# EAGLE design shift_register_MOSFET_1 (EAGLE 9.3.0)
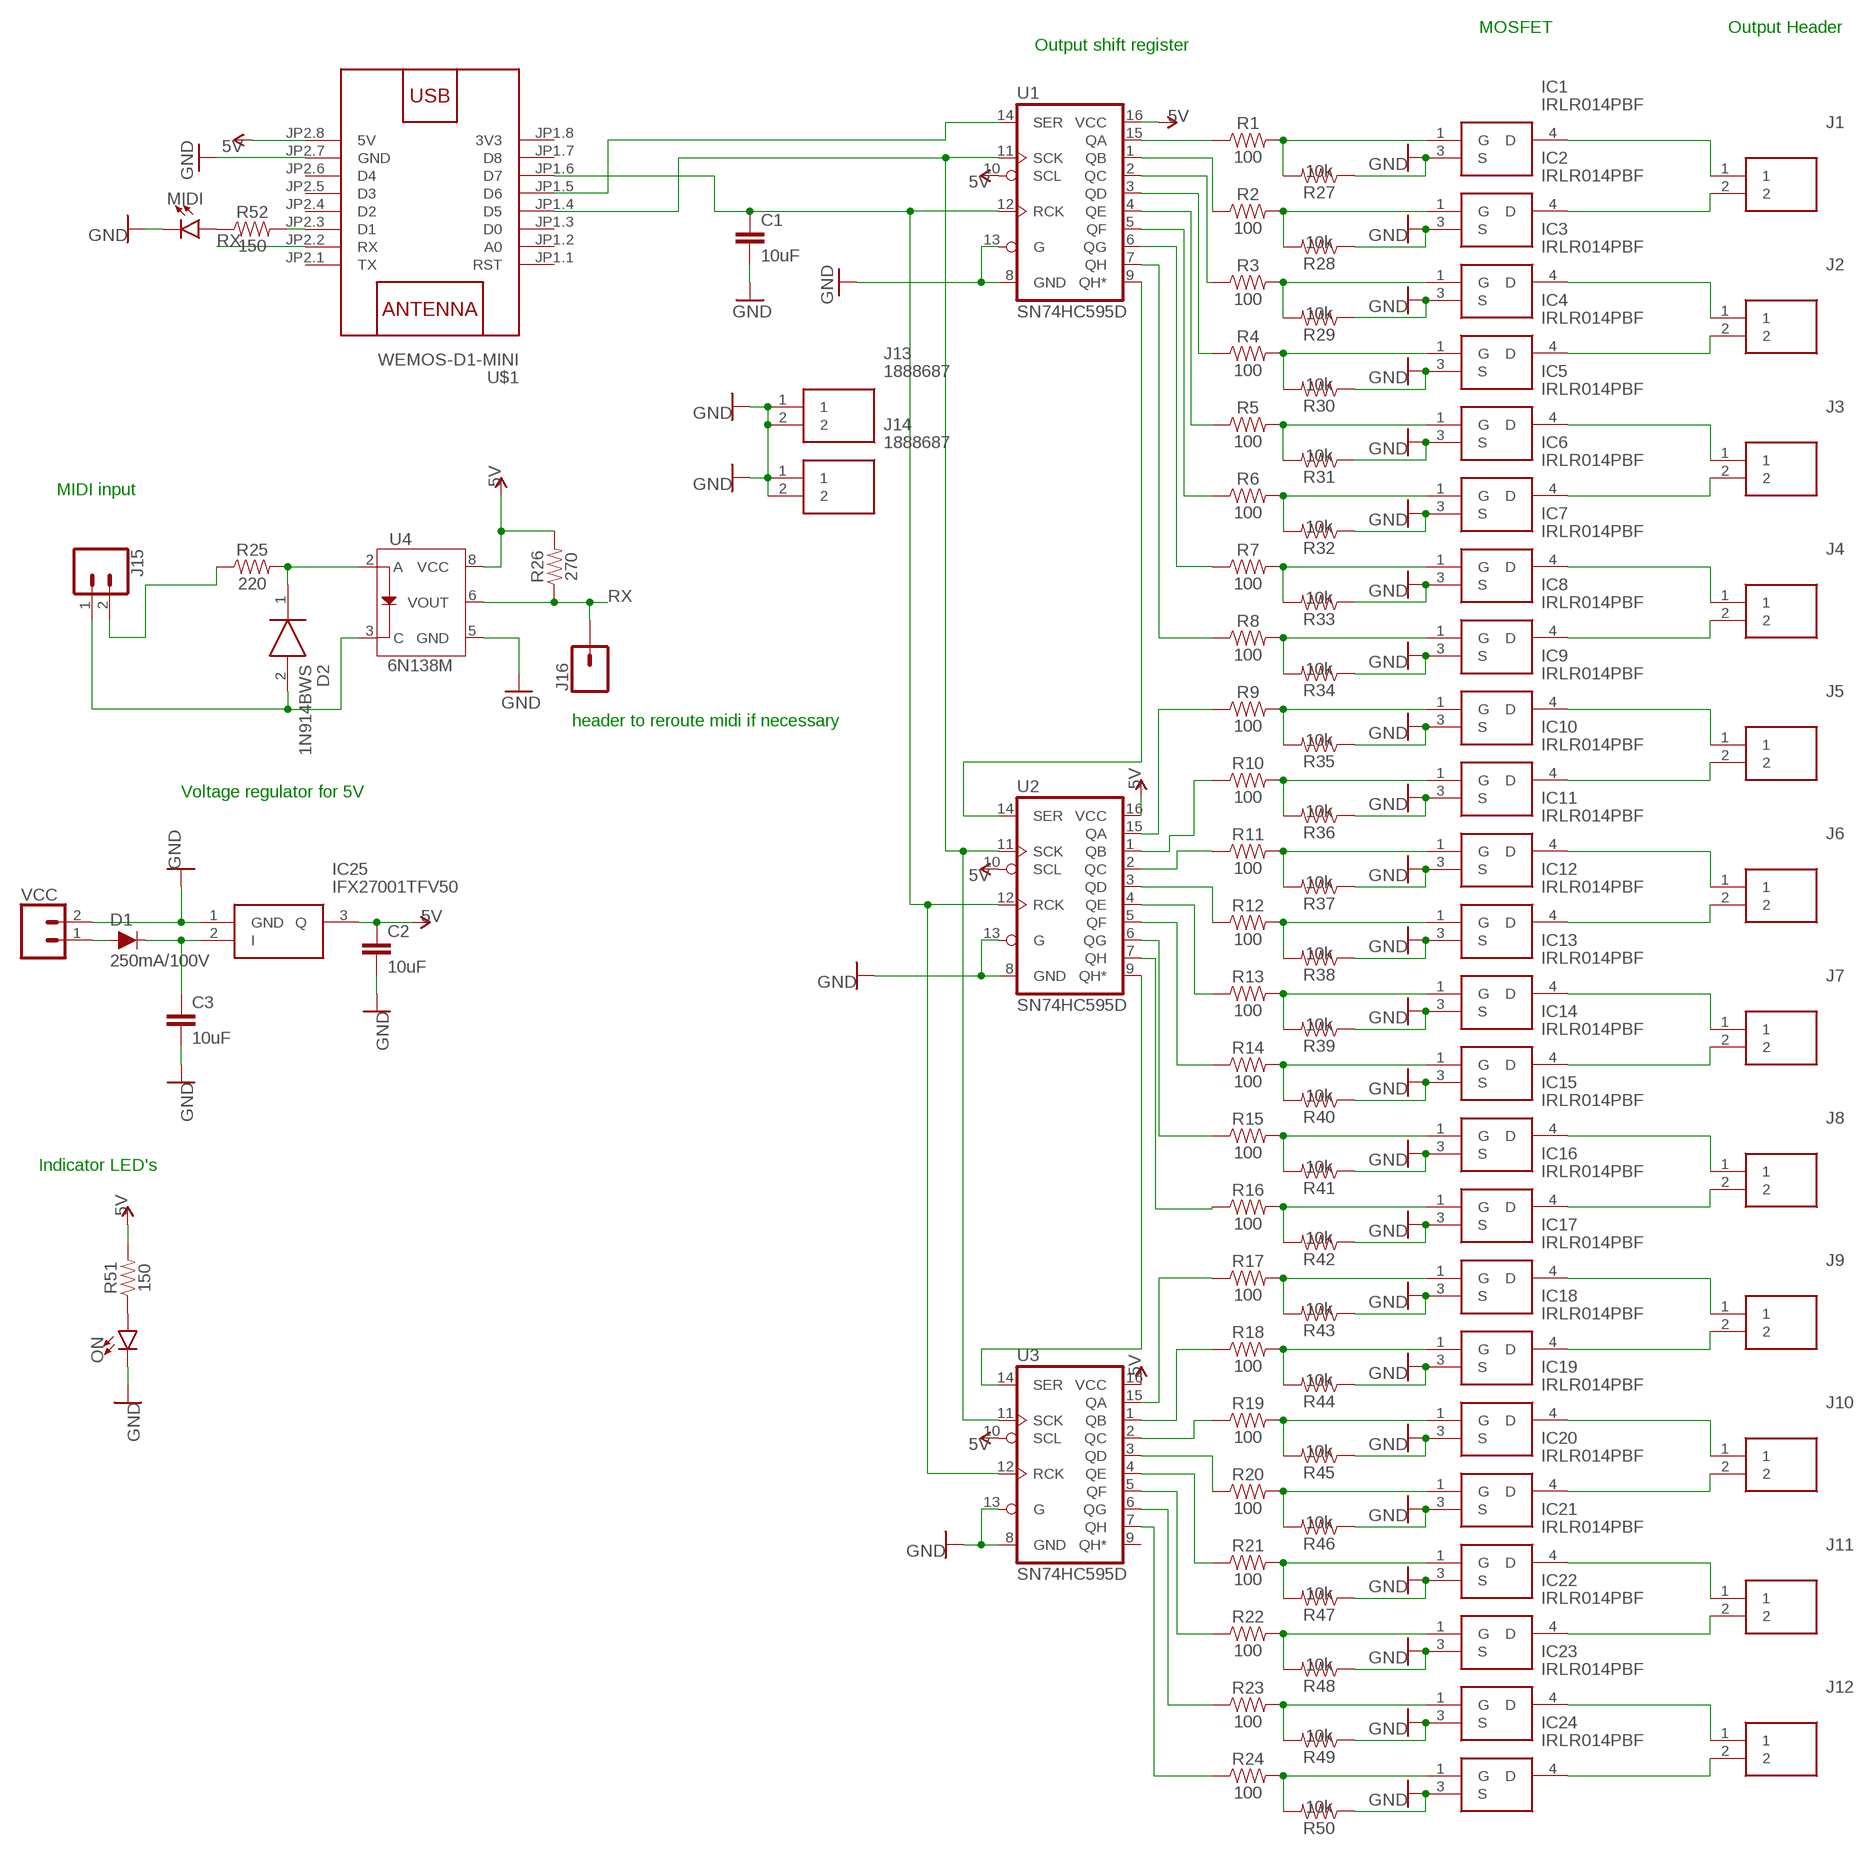
[diagram p0: schematic, sheet 1]

## Parts
C1  10uF  C-EUC0805  [C0805]
C2  10uF  C-EUC0805  [C0805]
C3  10uF  C-EUC0805  [C0805]
D1  250mA/100V  DIODE-BAS16J  [SOD-323]
D2  1N914BWS  [SODFL2513X90N]
IC1  IRLR014PBF  [TO228P990X238-3N]
IC2  IRLR014PBF  [TO228P990X238-3N]
IC3  IRLR014PBF  [TO228P990X238-3N]
IC4  IRLR014PBF  [TO228P990X238-3N]
IC5  IRLR014PBF  [TO228P990X238-3N]
IC6  IRLR014PBF  [TO228P990X238-3N]
IC7  IRLR014PBF  [TO228P990X238-3N]
IC8  IRLR014PBF  [TO228P990X238-3N]
IC9  IRLR014PBF  [TO228P990X238-3N]
IC10  IRLR014PBF  [TO228P990X238-3N]
IC11  IRLR014PBF  [TO228P990X238-3N]
IC12  IRLR014PBF  [TO228P990X238-3N]
IC13  IRLR014PBF  [TO228P990X238-3N]
IC14  IRLR014PBF  [TO228P990X238-3N]
IC15  IRLR014PBF  [TO228P990X238-3N]
IC16  IRLR014PBF  [TO228P990X238-3N]
IC17  IRLR014PBF  [TO228P990X238-3N]
IC18  IRLR014PBF  [TO228P990X238-3N]
IC19  IRLR014PBF  [TO228P990X238-3N]
IC20  IRLR014PBF  [TO228P990X238-3N]
IC21  IRLR014PBF  [TO228P990X238-3N]
IC22  IRLR014PBF  [TO228P990X238-3N]
IC23  IRLR014PBF  [TO228P990X238-3N]
IC24  IRLR014PBF  [TO228P990X238-3N]
IC25  IFX27001TFV50  [PG-TO252-3-11]
J1  1888687  [SHDR2W90P0X508_1X2_1016X950X15]
J2  1888687  [SHDR2W90P0X508_1X2_1016X950X15]
J3  1888687  [SHDR2W90P0X508_1X2_1016X950X15]
J4  1888687  [SHDR2W90P0X508_1X2_1016X950X15]
J5  1888687  [SHDR2W90P0X508_1X2_1016X950X15]
J6  1888687  [SHDR2W90P0X508_1X2_1016X950X15]
J7  1888687  [SHDR2W90P0X508_1X2_1016X950X15]
J8  1888687  [SHDR2W90P0X508_1X2_1016X950X15]
J9  1888687  [SHDR2W90P0X508_1X2_1016X950X15]
J10  1888687  [SHDR2W90P0X508_1X2_1016X950X15]
J11  1888687  [SHDR2W90P0X508_1X2_1016X950X15]
J12  1888687  [SHDR2W90P0X508_1X2_1016X950X15]
J13  1888687  [SHDR2W90P0X508_1X2_1016X950X15]
J14  1888687  [SHDR2W90P0X508_1X2_1016X950X15]
J15  CONN_02  [1X02]
J16  CONN_01  [1X01]
MIDI  LED3MM  [LED_3MM]
ON  LED3MM  [LED_3MM]
R1  100  RESISTOR0805  [0805]
R2  100  RESISTOR0805  [0805]
R3  100  RESISTOR0805  [0805]
R4  100  RESISTOR0805  [0805]
R5  100  RESISTOR0805  [0805]
R6  100  RESISTOR0805  [0805]
R7  100  RESISTOR0805  [0805]
R8  100  RESISTOR0805  [0805]
R9  100  RESISTOR0805  [0805]
R10  100  RESISTOR0805  [0805]
R11  100  RESISTOR0805  [0805]
R12  100  RESISTOR0805  [0805]
R13  100  RESISTOR0805  [0805]
R14  100  RESISTOR0805  [0805]
R15  100  RESISTOR0805  [0805]
R16  100  RESISTOR0805  [0805]
R17  100  RESISTOR0805  [0805]
R18  100  RESISTOR0805  [0805]
R19  100  RESISTOR0805  [0805]
R20  100  RESISTOR0805  [0805]
R21  100  RESISTOR0805  [0805]
R22  100  RESISTOR0805  [0805]
R23  100  RESISTOR0805  [0805]
R24  100  RESISTOR0805  [0805]
R25  220  RESISTOR0805  [0805]
R26  270  RESISTOR0805  [0805]
R27  10k  RESISTOR0805  [0805]
R28  10k  RESISTOR0805  [0805]
R29  10k  RESISTOR0805  [0805]
R30  10k  RESISTOR0805  [0805]
R31  10k  RESISTOR0805  [0805]
R32  10k  RESISTOR0805  [0805]
R33  10k  RESISTOR0805  [0805]
R34  10k  RESISTOR0805  [0805]
R35  10k  RESISTOR0805  [0805]
R36  10k  RESISTOR0805  [0805]
R37  10k  RESISTOR0805  [0805]
R38  10k  RESISTOR0805  [0805]
R39  10k  RESISTOR0805  [0805]
R40  10k  RESISTOR0805  [0805]
R41  10k  RESISTOR0805  [0805]
R42  10k  RESISTOR0805  [0805]
R43  10k  RESISTOR0805  [0805]
R44  10k  RESISTOR0805  [0805]
R45  10k  RESISTOR0805  [0805]
R46  10k  RESISTOR0805  [0805]
R47  10k  RESISTOR0805  [0805]
R48  10k  RESISTOR0805  [0805]
R49  10k  RESISTOR0805  [0805]
R50  10k  RESISTOR0805  [0805]
R51  150  RESISTOR0805  [0805]
R52  150  RESISTOR0805  [0805]
U1  SN74HC595D  74HC595D  [SO16]
U2  SN74HC595D  74HC595D  [SO16]
U3  SN74HC595D  74HC595D  [SO16]
U4  6N138M  OPTO_DARL_6N138S  [8-SMD]
U$1  WEMOS-D1-MINI  [WEMOS-D1-MINI]
VCC  CONN_02  [1X02]

## Nets
5V: C2.1 IC25.3(Q) R26.2 R51.2 U1.10(SCL) U1.16(VCC) U2.10(SCL) U2.16(VCC) U3.10(SCL) U3.16(VCC) U4.8(VCC) U$1.JP2.8(5V)
GND: C1.2 C2.2 C3.2 IC1.3(S) IC2.3(S) IC3.3(S) IC4.3(S) IC5.3(S) IC6.3(S) IC7.3(S) IC8.3(S) IC9.3(S) IC10.3(S) IC11.3(S) IC12.3(S) IC13.3(S) IC14.3(S) IC15.3(S) IC16.3(S) IC17.3(S) IC18.3(S) IC19.3(S) IC20.3(S) IC21.3(S) IC22.3(S) IC23.3(S) IC24.3(S) IC25.1(GND) J13.1 J13.2 J14.1 J14.2 MIDI.K(C) ON.K(C) R27.1 R28.1 R29.1 R30.1 R31.1 R32.1 R33.1 R34.1 R35.1 R36.1 R37.1 R38.1 R39.1 R40.1 R41.1 R42.1 R43.1 R44.1 R45.1 R46.1 R47.1 R48.1 R49.1 R50.1 U1.8(GND) U1.13(G) U2.8(GND) U2.13(G) U3.8(GND) U3.13(G) U4.5(GND) U$1.JP2.7(GND) VCC.2
N$1: IC2.1(G) R2.2 R28.2
N$2: IC1.4(D) J1.1
N$3: R1.1 U1.15(QA)
N$4: D1.A VCC.1
N$5: R8.1 U1.7(QH)
N$6: R7.1 U1.6(QG)
N$7: R2.1 U1.1(QB)
N$8: R5.1 U1.4(QE)
N$9: R6.1 U1.5(QF)
N$10: R4.1 U1.3(QD)
N$11: R3.1 U1.2(QC)
N$12: IC3.1(G) R3.2 R29.2
N$13: IC4.1(G) R4.2 R30.2
N$14: IC5.1(G) R5.2 R31.2
N$15: IC6.1(G) R6.2 R32.2
N$16: IC2.4(D) J1.2
N$17: IC7.1(G) R7.2 R33.2
N$18: IC8.1(G) R8.2 R34.2
N$19: IC1.1(G) R1.2 R27.2
N$20: C3.1 D1.C IC25.2(I)
N$21: U1.9(QH*) U2.14(SER)
N$22: U1.11(SCK) U2.11(SCK) U3.11(SCK) U$1.JP1.4(D5)
N$23: C1.1 U1.12(RCK) U2.12(RCK) U3.12(RCK) U$1.JP1.6(D7)
N$24: U1.14(SER) U$1.JP1.5(D6)
N$25: IC3.4(D) J2.1
N$26: R12.1 U2.3(QD)
N$27: R11.1 U2.2(QC)
N$28: ON.A R51.1
N$29: R9.1 U2.15(QA)
N$30: IC9.1(G) R9.2 R35.2
N$31: IC10.1(G) R10.2 R36.2
N$32: IC11.1(G) R11.2 R37.2
N$33: IC12.1(G) R12.2 R38.2
N$34: IC13.1(G) R13.2 R39.2
N$35: R13.1 U2.4(QE)
N$36: R14.1 U2.5(QF)
N$37: IC4.4(D) J2.2
N$38: R15.1 U2.6(QG)
N$39: R16.1 U2.7(QH)
N$40: U2.9(QH*) U3.14(SER)
N$41: J15.2 R25.1
N$42: IC19.1(G) R19.2 R45.2
N$43: IC20.1(G) R20.2 R46.2
N$44: D2.1(K) R25.2 U4.2(A)
N$45: D2.2(A) J15.1 U4.3(C)
N$46: R17.1 U3.15(QA)
N$47: R18.1 U3.1(QB)
N$48: IC21.1(G) R21.2 R47.2
N$49: IC22.1(G) R22.2 R48.2
N$50: IC23.1(G) R23.2 R49.2
N$51: IC24.1(G) R24.2 R50.2
N$52: IC14.1(G) R14.2 R40.2
N$53: IC15.1(G) R15.2 R41.2
N$54: IC16.1(G) R16.2 R42.2
N$55: IC17.1(G) R17.2 R43.2
N$56: IC18.1(G) R18.2 R44.2
N$57: IC5.4(D) J3.1
N$58: IC6.4(D) J3.2
N$59: IC7.4(D) J4.1
N$60: IC8.4(D) J4.2
N$61: IC9.4(D) J5.1
N$62: IC10.4(D) J5.2
N$63: IC11.4(D) J6.1
N$64: IC12.4(D) J6.2
N$65: IC13.4(D) J7.1
N$66: IC14.4(D) J7.2
N$67: IC15.4(D) J8.1
N$68: IC16.4(D) J8.2
N$69: IC17.4(D) J9.1
N$70: IC18.4(D) J9.2
N$71: IC19.4(D) J10.1
N$72: IC20.4(D) J10.2
N$73: IC21.4(D) J11.1
N$74: IC22.4(D) J11.2
N$75: IC23.4(D) J12.1
N$76: IC24.4(D) J12.2
N$77: R19.1 U3.2(QC)
N$78: R20.1 U3.3(QD)
N$79: R21.1 U3.4(QE)
N$80: R22.1 U3.5(QF)
N$81: R23.1 U3.6(QG)
N$82: R24.1 U3.7(QH)
N$84: R10.1 U2.1(QB)
N$85: MIDI.A R52.1
N$86: R52.2 U$1.JP2.3(D1)
RX: J16.1 R26.1 U4.6(VOUT) U$1.JP2.2(RX)
Unconnected: U3.9(QH*) U$1.JP1.1(RST) U$1.JP1.2(A0) U$1.JP1.3(D0) U$1.JP1.7(D8) U$1.JP2.1(TX) U$1.JP2.4(D2) U$1.JP2.5(D3) U$1.JP2.6(D4)

## Notes on the sheet
- MOSFET | Output Header
- Output shift register
- MIDI input
- header to reroute midi if necessary
- Voltage regulator for 5V
- Indicator LED's

## Power pins joined to a net without a drawn wire
3V3: U$1.JP1.8(3V3)

## Library data of the parts
C1-C3 = Clean-Kong:C-EU: CAPACITOR, European symbol
D1 = SparkFun-DiscreteSemi:DIODE: Diode These are standard reverse protection diodes and small signal diodes. SparkFun Products: SparkFun SparkPunk Sound Kit <https://www.sparkfun.com/products/11177> SparkFun ESP8266 Thing <https://www.sparkfun.com/products/13231>; PROD_ID: DIO-09646
D2 = samacsys:1N914BWS: Diode, Fairchild, 1N914BWS Fairchild 1N914BWS, SMT Diode, 75V 300mA, 4ns, 2-Pin SOD-323F Source: Datasheet <https://www.fairchildsemi.com/datasheets/1N/1N4148WS.pdf>; DESCRIPTION: Diode, Fairchild, 1N914BWS Fairchild 1N914BWS, SMT Diode, 75V 300mA, 4ns, 2-Pin SOD-323F; HEIGHT: 0.9mm; MANUFACTURER_NAME: Fairchild Semiconductor; MANUFACTURER_PART_NUMBER: 1N914BWS; MOUSER_PART_NUMBER: 512-1N914BWS; MOUSER_PRICE-STOCK: https://www.mouser.com/Search/Refine.aspx?Keyword=512-1N914BWS; RS_PART_NUMBER: 8051021P; RS_PRICE-STOCK: http://uk.rs-online.com/web/p/products/8051021P
IC1-IC24 = samacsys:IRLR014PBF: IRLR014PBF, N-channel MOSFET Transistor, 7.7 A 60 V, 3-Pin D-PAK Source: Datasheet <http://www.vishay.com/docs/91321/sihlr014.pdf>; ALLIED_NUMBER: R1081867; ALLIED_PRICE-STOCK: http://www.alliedelec.com/vishay-dale-irlr014pbf/R1081867/; DESCRIPTION: IRLR014PBF, N-channel MOSFET Transistor, 7.7 A 60 V, 3-Pin D-PAK; HEIGHT: mm; MANUFACTURER_NAME: Vishay; MANUFACTURER_PART_NUMBER: IRLR014PBF; MOUSER_PART_NUMBER: 844-IRLR014PBF; MOUSER_PRICE-STOCK: https://www.mouser.com/Search/Refine.aspx?Keyword=844-IRLR014PBF; RS_PART_NUMBER: 1780908; RS_PRICE-STOCK: http://uk.rs-online.com/web/p/products/1780908
IC25 = samacsys:IFX27001TFV50: Infineon IFX27001TFV50 Linear Voltage Regulator, 1A, 5 V, +/-3% 3-Pin DPAK Source: Datasheet <https://www.infineon.com/dgdl/Infineon-IFX27001-DS-v01_01-EN.pdf?fileId=5546d4626176435901619e0eecba517a>; DESCRIPTION: Infineon IFX27001TFV50 Linear Voltage Regulator, 1A, 5 V, +/-3% 3-Pin DPAK; HEIGHT: mm; MANUFACTURER_NAME: Infineon; MANUFACTURER_PART_NUMBER: IFX27001TFV50; RS_PART_NUMBER: 1459664; RS_PRICE-STOCK: http://uk.rs-online.com/web/p/products/1459664
J1-J14 = samacsys:1888687: Phoenix Contact COMBICON MKDSN Series 5.08mm Pitch Straight PCB Terminal Block with Screw Termination, Through Hole Source: Datasheet <https://componentsearchengine.com/Datasheets/1/1888687.pdf>; ALLIED_NUMBER: 70054422; ALLIED_PRICE-STOCK: https://www.alliedelec.com/phoenixcontact-1888687/70054422/; DESCRIPTION: Phoenix Contact COMBICON MKDSN Series 5.08mm Pitch Straight PCB Terminal Block with Screw Termination, Through Hole; HEIGHT: 15mm; MANUFACTURER_NAME: Phoenix Contact; MANUFACTURER_PART_NUMBER: 1888687; MOUSER_PART_NUMBER: 651-1888687; MOUSER_PRICE-STOCK: https://www.mouser.com/Search/Refine.aspx?Keyword=651-1888687; RS_PART_NUMBER: 2509972333; RS_PRICE-STOCK: http://uk.rs-online.com/web/p/products/2509972333
J15 VCC = SparkFun-Connectors:CONN_02: Multi connection point. Often used as Generic Header-pin footprint for 0.1 inch spaced/style header connections On any of the 0.1 inch spaced packages, you can populate with these: Break Away Headers - Straight <https://www.sparkfun.com/products/116> (PRT-00116) Break Away Male Headers - Right Angle <https://www.sparkfun.com/products/553> (PRT-00553) Female Headers <https://www.sparkfun.com/products/115> (PRT-00115) Break Away Headers - Machine Pin <https://www.sparkfun.com/products/117> (PRT-00117) Break Away Female Headers - Swiss Machine Pin <https://www.sparkfun.com/products/743> (PRT-00743) For SCREWTERMINALS and SPRING TERMINALS visit here: Screw Terimnals on SparkFun.com <https://www.sparkfun.com/search/results?term=Screw+Terminals> (5mm/3.5mm/2.54mm spacing) This device is also useful as a general connection point to wire up your design to another part of your project. Our various solder wires solder well into these plated through hole pads. Hook-Up Wire - Assortment (Stranded, 22 AWG) <https://www.sparkfun.com/products/11375> (PRT-11375) Hook-Up Wire - Assortment (Solid Core, 22 AWG) <https://www.sparkfun.com/products/11367> (PRT-11367) View the entire wire category on our website here <https://www.sparkfun.com/categories/141> Special notes: Molex polarized connector foot print use with: PRT-08233 with associated crimp pins and housings. 2.54_SCREWTERM for use with PRT-10571. 3.5mm Screw Terminal footprints for PRT-08084 5mm Screw Terminal footprints for use with PRT-08432
J16 = SparkFun-Connectors:CONN_01: Single connection point. Often used as Generic Header-pin footprint for 0.1 inch spaced/style header connections On any of the 0.1 inch spaced packages, you can populate with these: Break Away Headers - Straight <https://www.sparkfun.com/products/116> (PRT-00116) Break Away Male Headers - Right Angle <https://www.sparkfun.com/products/553> (PRT-00553) Female Headers <https://www.sparkfun.com/products/115> (PRT-00115) Break Away Headers - Machine Pin <https://www.sparkfun.com/products/117> (PRT-00117) Break Away Female Headers - Swiss Machine Pin <https://www.sparkfun.com/products/743> (PRT-00743) This device is also useful as a general connection point to wire up your design to another part of your project. Our various solder wires solder well into these plated through hole pads. Hook-Up Wire - Assortment (Stranded, 22 AWG) <https://www.sparkfun.com/products/11375> (PRT-11375) Hook-Up Wire - Assortment (Solid Core, 22 AWG) <https://www.sparkfun.com/products/11367> (PRT-11367) View the entire wire category on our website here <https://www.sparkfun.com/categories/141> Special notes: SMTSO-256-ET is a "flush mount" nut for a 4-40 screw. We mostly use this on specialty testbeds; it is a nice way to connect hardware to your PCB at an adjustable hieght. Also note, the SNAP packages are for using a snappable style connector. We sell a baggie of snaps and they are also used on two LilyPad designs: Snap Assortment - 30 pack (male and female) <https://www.sparkfun.com/products/11347> (DEV-11347) LilyPad Arduino SimpleSnap <https://www.sparkfun.com/products/10941> (DEV-10941) LilyPad SimpleSnap Protoboard <https://www.sparkfun.com/products/10940> (DEV-10940)
MIDI ON = SparkFun-LED:LED: LED (Generic) Standard schematic elements and footprints for 5mm, 3mm, 1206, and 0603 sized LEDs. Generic LEDs with no color specified.; PROD_ID: DIO-08794
R1-R52 = SparkFun-Resistors:RESISTOR: Generic Resistor Package
U1-U3 = SparkFun-IC-Logic:74*595: 8-Bit Shift Register (Serial to Parallel) Datasheet <http://cdn.sparkfun.com/datasheets/BreakoutBoards/MM74HC595.pdf> SparkFun Products SparkFun Shift Register Breakout - 74HC595 <https://www.sparkfun.com/products/10680> (BOB-10680); PROD_ID: IC-07875
U4 = SparkFun-DiscreteSemi:OPTO_DARL_6N138S: Optoisolator, darlington pair output Optocoupler consisting of an AlGaAs LED optically coupled to a high gain split darlington photodetector. SparkFun Products: SparkFun MIDI Shield <https://www.sparkfun.com/products/12898>; PROD_ID: IC-09482
U$1 = diy-modules:WEMOS-D1-MINI: WEMOS D1 mini: Mini Wi-Fi Board based on ESP-8266 device More details can be found here: https://www.wemos.cc/product/d1-mini.html Click here to find device on ebay.com <http://www.ebay.com/sch/wemos+d1+mini+nodemcu>

## Board
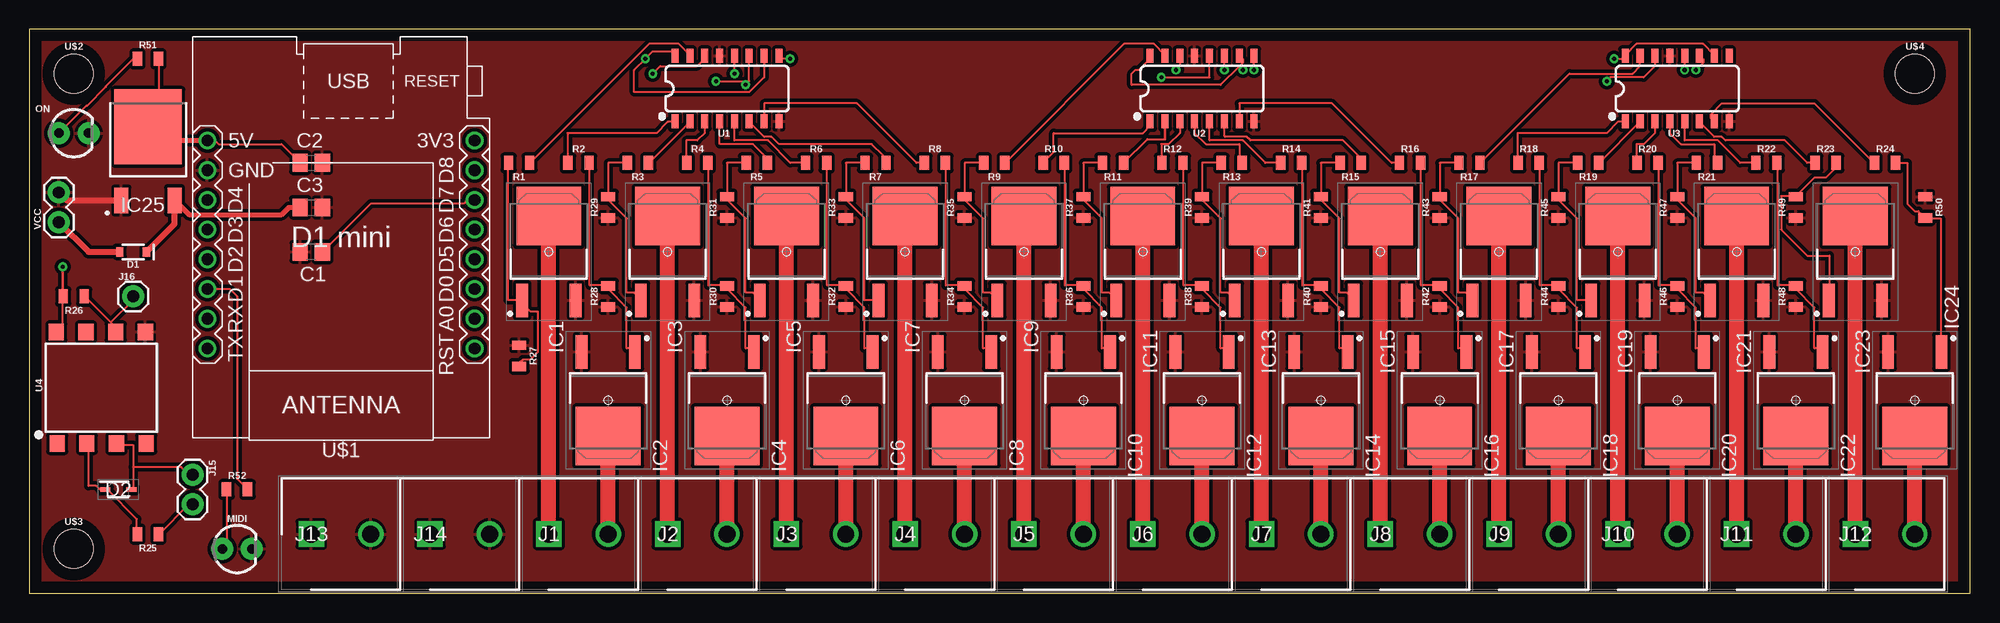
[diagram p1: board, top side]
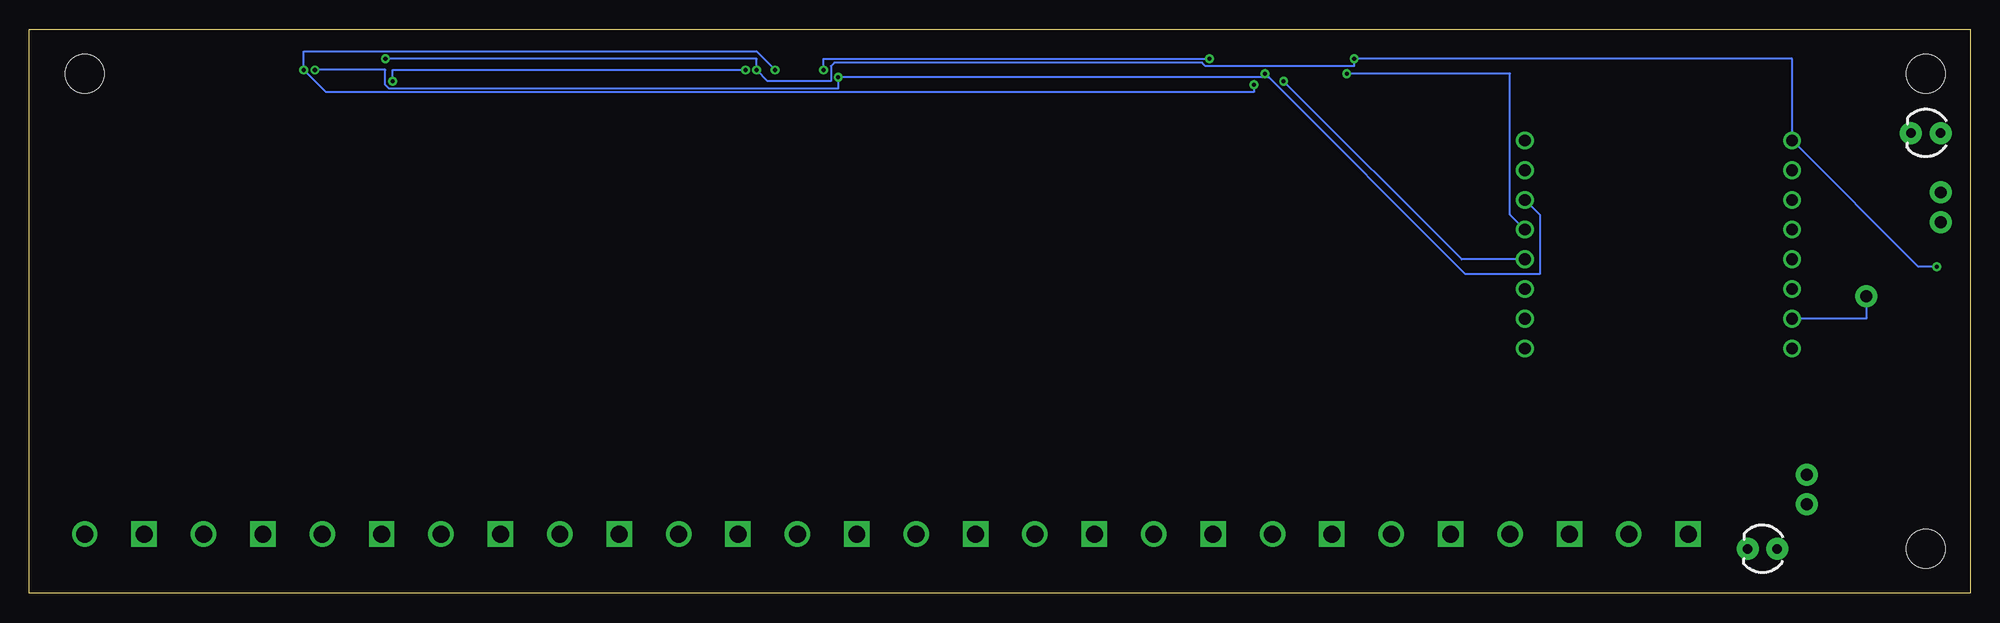
[diagram p2: board, bottom side, seen from below]

Size 166.04 x 48.25 mm. Coordinates in mm from the lower left corner, seen from the top.
Outline: 0,0 166.04,0 166.04,48.25 0,48.25 0,0
Copper layers (1*16): Top 0.035mm / dielectric 1.5mm / Bottom 0.035mm
Design rules "default": minimum track width 6mil, minimum drill 0.35mm, track to track 6mil, track to pad 6mil, pad to pad 6mil, via to via 6mil, smd to smd 6mil, copper to edge 40mil, drill to drill 6mil, minimum pad ring 10mil, minimum via ring 8mil, stop-mask expansion 4mil, vias tented up to drill 0mil, thermal gap 10mil

### Footprints (pad centres in the part's own frame; a part is rotated, then mirrored left to right if it is on the bottom)
C0805 = smd 1.3 x 1.5: 1 -0.95,0; 2 0.95,0
SOD-323 = smd 0.63 x 0.83: A 1.15,0; C -1.15,0
SODFL2513X90N = smd 0.87 x 0.42: 1 -1.125,0; 2 1.125,0
TO228P990X238-3N = smd 2.85 x 1: 1 -4.15,2.28; 3 -4.15,-2.28 | smd 5 x 5.55: 4 3.05,0
PG-TO252-3-11 = smd 1.2 x 2.2: 1 -2.28,-8.3; 2 2.28,-8.3 | smd 5.8 x 6.4: 3 0,-2
SHDR2W90P0X508_1X2_1016X950X15 = drill 1.45 pad 2.175 square: 1 0,0 | drill 1.45 pad 2.175: 2 5.08,0
1X02 = drill 1.016 pad 1.88: 1 0,0; 2 2.54,0
1X01 = drill 1.016 pad 1.88: 1 0,0
LED_3MM = drill 0.813 pad 1.88: A -1.27,0; K 1.27,0
0805 = smd 0.8 x 1.2: 1 -0.9,0; 2 0.9,0
SO16 = smd 0.6 x 1.2: 1 -4.445,-2.8; 2 -3.175,-2.8; 3 -1.905,-2.8; 4 -0.635,-2.8; 5 0.635,-2.8; 6 1.905,-2.8; 7 3.175,-2.8; 8 4.445,-2.8; 9 4.445,2.8; 10 3.175,2.8; 11 1.905,2.8; 12 0.635,2.8; 13 -0.635,2.8; 14 -1.905,2.8; 15 -3.175,2.8; 16 -4.445,2.8
8-SMD = smd 1.3 x 1.4: 1 -3.96,-4.96; 2 -1.42,-4.96; 3 1.12,-4.96; 4 3.66,-4.96; 5 3.59,4.58; 6 1.05,4.58; 7 -1.49,4.58; 8 -4.03,4.58
WEMOS-D1-MINI = drill 1: JP1.1 -11.43,9.525; JP1.2 -11.43,6.985; JP1.3 -11.43,4.445; JP1.4 -11.43,1.905; JP1.5 -11.43,-0.635; JP1.6 -11.43,-3.175; JP1.7 -11.43,-5.715; JP1.8 -11.43,-8.255; JP2.1 11.43,9.525; JP2.2 11.43,6.985; JP2.3 11.43,4.445; JP2.4 11.43,1.905; JP2.5 11.43,-0.635; JP2.6 11.43,-3.175; JP2.7 11.43,-5.715; JP2.8 11.43,-8.255
STAND-OFF = hole 3.302: 0,0

### Placement (x,y rotation side)
C1  24.13,29.21 180 top
C2  24.13,36.83 0 top
C3  24.13,33.02 0 top
D1  8.89,29.21 180 top
D2  7.62,8.89 0 top
IC1  44.45,29.21 90 top
IC2  49.53,16.51 270 top
IC3  54.61,29.21 90 top
IC4  59.69,16.51 270 top
IC5  64.77,29.21 90 top
IC6  69.85,16.51 270 top
IC7  74.93,29.21 90 top
IC8  80.01,16.51 270 top
IC9  85.09,29.21 90 top
IC10  90.17,16.51 270 top
IC11  95.25,29.21 90 top
IC12  100.33,16.51 270 top
IC13  105.41,29.21 90 top
IC14  110.49,16.51 270 top
IC15  115.57,29.21 90 top
IC16  120.65,16.51 270 top
IC17  125.73,29.21 90 top
IC18  130.81,16.51 270 top
IC19  135.89,29.21 90 top
IC20  140.97,16.51 270 top
IC21  146.05,29.21 90 top
IC22  151.13,16.51 270 top
IC23  156.21,29.21 90 top
IC24  161.29,16.51 270 top
IC25  10.16,41.91 0 top
J1  44.45,5.08 0 top
J2  54.61,5.08 0 top
J3  64.77,5.08 0 top
J4  74.93,5.08 0 top
J5  85.09,5.08 0 top
J6  95.25,5.08 0 top
J7  105.41,5.08 0 top
J8  115.57,5.08 0 top
J9  125.73,5.08 0 top
J10  135.89,5.08 0 top
J11  146.05,5.08 0 top
J12  156.21,5.08 0 top
J13  24.13,5.08 0 top
J14  34.29,5.08 0 top
J15  13.97,10.16 270 top
J16  8.89,25.4 0 top
MIDI  17.78,3.81 0 top
ON  3.81,39.37 0 top
R1  41.91,36.83 180 top
R2  46.99,36.83 0 top
R3  52.07,36.83 180 top
R4  57.15,36.83 0 top
R5  62.23,36.83 180 top
R6  67.31,36.83 0 top
R7  72.39,36.83 180 top
R8  77.47,36.83 0 top
R9  82.55,36.83 180 top
R10  87.63,36.83 0 top
R11  92.71,36.83 180 top
R12  97.79,36.83 0 top
R13  102.87,36.83 180 top
R14  107.95,36.83 0 top
R15  113.03,36.83 180 top
R16  118.11,36.83 0 top
R17  123.19,36.83 180 top
R18  128.27,36.83 0 top
R19  133.35,36.83 180 top
R20  138.43,36.83 0 top
R21  143.51,36.83 180 top
R22  148.59,36.83 0 top
R23  153.67,36.83 0 top
R24  158.75,36.83 0 top
R25  10.16,5.08 180 top
R26  3.81,25.4 180 top
R27  41.91,20.32 270 top
R28  49.53,25.4 90 top
R29  49.53,33.02 90 top
R30  59.69,25.4 90 top
R31  59.69,33.02 90 top
R32  69.85,25.4 90 top
R33  69.85,33.02 90 top
R34  80.01,25.4 90 top
R35  80.01,33.02 90 top
R36  90.17,25.4 90 top
R37  90.17,33.02 90 top
R38  100.33,25.4 90 top
R39  100.33,33.02 90 top
R40  110.49,25.4 90 top
R41  110.49,33.02 90 top
R42  120.65,25.4 90 top
R43  120.65,33.02 90 top
R44  130.81,25.4 90 top
R45  130.81,33.02 90 top
R46  140.97,25.4 90 top
R47  140.97,33.02 90 top
R48  151.13,25.4 90 top
R49  151.13,33.02 90 top
R50  162.18,33.02 270 top
R51  10.16,45.72 0 top
R52  17.78,8.89 0 top
U1  59.69,43.18 0 top
U2  100.33,43.18 0 top
U3  140.97,43.18 0 top
U4  6.35,17.78 0 top
U$1  26.67,30.48 180 top
U$2  [STAND-OFF]  3.81,44.45 0 top
U$3  [STAND-OFF]  3.81,3.81 0 top
U$4  [STAND-OFF]  161.29,44.45 0 top
VCC  2.54,31.75 90 top

### Tracks (layer width: path | path; a pad name or v marks a point on that pad's centre or on a via)
5V  (via drill 0.35)
  Top 0.152: U3.10 144.15,46.04 143.19,46.99 137.48,46.99 136.53,46.04 U3.16 136.53,45.72 v135.57,45.72 | 103.5,45.09 103.82,45.4 103.82,45.72 103.5,45.72 U2.10 | 103.5,45.09 101.92,43.5 94.3,43.5 94.3,44.45 94.61,44.77 94.93,44.77 95.89,45.72 U2.16 | 103.5,45.09 v103.82,44.77 | U1.10 62.87,44.13 61.59,42.86 51.75,42.86 51.75,44.77 v52.7,45.72 53.34,46.35 54.93,46.35 55.24,46.04 U1.16 | R26.2 2.86,25.4 v2.86,27.94 2.86,22.54 2.54,22.54 U4.8 | U$1.JP2.8 15.88,38.73 16.19,38.42 21.59,38.42 C2.1 | R51.2 11.06,40.81 IC25.3
  Top 0.406: IC25.3 11.34,38.73 U$1.JP2.8
  Bottom 0.152: v135.57,45.72 103.82,45.72 v103.82,44.77 102.87,43.81 97.47,43.81 97.47,45.09 97.16,45.4 65.72,45.4 65.41,45.09 52.7,45.09 v52.7,45.72 15.24,45.72 U$1.JP2.8 4.45,27.94 v2.86,27.94
GND
  Top 0.508: VCC.2 3.22,33.61 IC25.1
  pour Top (isolate 0.305): 0,0 0,48.26 165.74,48.26 165.74,0
N$1
  Top 0.152: IC2.1 51.75,20.95 51.12,20.95 51.12,24.45 49.53,26.04 R28.2 49.53,26.35 47.94,26.35 47.94,36.83 R2.2
N$2
  Top 0.152: IC1.4 44.45,31.75
  Top 1.27: J1.1 44.45,31.75
N$3
  Top 0.152: R1.1 42.86,36.83 53.02,46.99 55.56,46.99 56.52,46.04 U1.15
N$4
  Top 0.508: VCC.1 5.08,29.21 D1.A
N$5
  Top 0.152: U1.7 62.87,41.91 70.8,41.91 75.88,36.83 R8.1
N$6
  Top 0.152: U1.6 61.59,40.32 62.87,39.05 63.5,39.05 64.14,38.42 72.07,38.42 73.03,37.47 73.03,36.83 R7.1
N$7
  Top 0.152: R2.1 46.04,36.83 46.04,39.37 53.66,39.37 54.61,40.32 55.24,40.32 U1.1
N$8
  Top 0.152: U1.4 59.05,38.42 61.91,38.42 62.87,37.47 62.87,36.83 R5.1
N$9
  Top 0.152: U1.5 60.33,38.73 63.18,38.73 65.09,36.83 R6.1
N$10
  Top 0.152: U1.3 57.78,39.37 57.15,38.73 56.2,38.73 56.2,36.83 R4.1
N$11
  Top 0.152: R3.1 53.02,36.83 56.52,40.32 U1.2
N$12
  Top 0.152: R3.2 49.53,36.83 R29.2 49.53,33.66 51.12,32.07 51.12,25.72 51.75,25.72 52.39,25.08 IC3.1
N$13
  Top 0.152: IC4.1 61.91,20.95 61.28,20.95 61.28,24.45 59.69,26.04 R30.2 59.69,26.35 58.1,26.35 58.1,36.83 R4.2
N$14
  Top 0.152: R5.2 59.69,36.83 R31.2 59.69,33.66 61.28,32.07 61.28,25.72 61.91,25.72 62.55,25.08 IC5.1
N$15
  Top 0.152: IC6.1 72.07,20.95 71.44,20.95 71.44,24.45 69.85,26.04 R32.2 69.85,26.35 68.26,26.35 68.26,36.83 R6.2
N$16
  Top 1.27: J1.2 IC2.4
N$17
  Top 0.152: R7.2 69.85,36.83 R33.2 69.85,33.66 71.44,32.07 71.44,25.08 72.39,25.08 IC7.1
N$18
  Top 0.152: IC8.1 82.23,20.95 81.6,20.95 81.6,24.45 80.01,26.04 R34.2 80.01,26.35 78.42,26.35 78.42,36.83 R8.2
N$19
  Top 0.152: R27.2 41.91,19.68 42.23,20 42.86,20 43.5,20.64 43.5,24.13 42.86,24.13 42.23,24.77 IC1.1 41.91,25.08 40.96,25.08 40.96,36.83 R1.2
N$20
  Top 0.406: IC25.2 13.66,32.38 21.59,32.38 22.23,33.02 C3.1
  Top 0.508: D1.C 12.44,31.61 IC25.2
N$21  (via drill 0.35)
  Top 0.152: v65.09,45.72 64.14,45.72 U1.9 | v98.11,44.77 98.42,45.09 U2.14
  Bottom 0.152: v65.09,45.72 98.11,45.72 v98.11,44.77
N$22  (via drill 0.35)
  Top 0.152: v102.23,44.77 U2.11 | v142.56,44.77 143.19,45.4 143.19,45.72 142.88,45.72 U3.11 | U1.11 61.59,43.81 61.28,43.81 | v58.74,43.81 61.28,43.81 | 61.28,43.81 v61.28,43.5
  Bottom 0.152: v102.23,44.77 103.82,46.35 142.56,46.35 v142.56,44.77 140.65,42.86 61.28,42.86 v61.28,43.5 | v58.74,43.81 43.5,28.57 U$1.JP1.4
N$23  (via drill 0.35)
  Top 0.152: v60.33,44.45 U1.12 | U2.12 100.97,44.13 v96.84,44.13 | v141.6,44.77 U3.12 | U$1.JP1.6 37.47,33.66 37.15,33.34 29.21,33.34 C1.1
  Bottom 0.152: 60.01,44.13 43.18,27.3 36.83,27.3 36.83,32.38 U$1.JP1.6 | 60.01,44.13 v60.33,44.45 | 60.01,44.13 v96.84,44.13 96.84,43.18 135.25,43.18 135.57,43.5 135.57,44.77 v141.6,44.77
N$24  (via drill 0.35)
  Top 0.152: v53.34,44.45 53.98,45.09 57.15,45.09 57.78,45.72 U1.14
  Bottom 0.152: v53.34,44.45 39.37,44.45 39.37,32.38 U$1.JP1.5
N$25
  Top 1.27: J2.1 IC3.4
N$26
  Top 0.152: U2.3 98.42,39.37 97.47,38.42 96.84,38.42 96.84,36.83 R12.1
N$27
  Top 0.152: R11.1 95.64,38.86 97.16,38.86
  Top 0.2: 97.16,38.86 U2.2
N$28
  Top 0.152: R51.1 8.89,45.72 6.55,43.38 6.55,43.31 4.95,41.71 4.88,41.71 ON.A
N$29
  Top 0.152: R9.1 83.5,36.83 93.66,46.99 96.2,46.99 97.16,46.04 U2.15
N$30
  Top 0.152: R9.2 80.01,36.83 R35.2 80.01,33.66 81.6,32.07 81.6,25.72 82.23,25.72 82.87,25.08 IC9.1
N$31
  Top 0.152: IC10.1 92.39,20.95 91.76,20.95 91.76,24.45 90.17,26.04 R36.2 90.17,26.35 88.58,26.35 88.58,36.83 R10.2
N$32
  Top 0.152: R11.2 90.17,36.83 R37.2 90.17,33.66 91.76,32.07 91.76,25.72 92.39,25.72 93.03,25.08 IC11.1
N$33
  Top 0.152: IC12.1 102.55,20.95 101.92,20.95 101.92,24.45 100.33,26.04 R38.2 100.33,26.35 98.74,26.35 98.74,36.83 R12.2
N$34
  Top 0.152: R13.2 100.33,36.83 R39.2 100.33,33.66 101.92,32.07 101.92,25.72 102.55,25.72 103.19,25.08 IC13.1
N$35
  Top 0.152: U2.4 99.69,39.37 100.65,38.42 103.5,38.42 103.5,36.83 R13.1
N$36
  Top 0.152: U2.5 100.97,38.73 103.82,38.73 105.73,36.83 R14.1
N$37
  Top 1.27: J2.2 IC4.4
N$38
  Top 0.152: R15.1 113.67,36.83 113.67,37.47 112.39,38.73 104.46,38.73 104.14,39.05 102.3,39.05 102.23,39.12 U2.6
N$39
  Top 0.152: U2.7 103.5,41.91 111.44,41.91 116.52,36.83 R16.1
N$40  (via drill 0.35)
  Top 0.152: v104.78,44.77 U2.9 | v134.94,43.81 135.25,44.13 138.11,44.13 139.06,45.09 U3.14
  Bottom 0.152: v104.78,44.77 134.94,44.77 v134.94,43.81
N$41
  Top 0.152: J15.2 13.65,7.62 11.11,5.08 R25.1
N$42
  Top 0.152: R19.2 130.81,36.83 R45.2 130.81,33.66 132.4,32.07 132.4,25.08 133.35,25.08 IC19.1
N$43
  Top 0.152: IC20.1 143.19,20.95 142.56,20.95 142.56,24.45 140.97,26.04 R46.2 140.97,26.35 139.38,26.35 139.38,36.83 R20.2
N$44
  Top 0.152: R25.2 9.21,5.08 9.21,6.35 6.67,8.89 D2.1 6.03,8.89 5.71,9.21 5.08,9.21 5.08,12.7 U4.2
N$45
  Top 0.152: 8.89,10.79 8.89,12.7 7.62,12.7 U4.3 | 8.89,10.79 8.89,8.89 D2.2 | 8.89,10.79 13.02,10.79 13.65,10.16 J15.1
N$46
  Top 0.152: R17.1 124.14,36.83 131.76,44.45 137.16,44.45 137.79,45.09 U3.15
N$47
  Top 0.152: R18.1 127.32,36.83 127.32,39.37 134.94,39.37 135.89,40.32 136.53,40.32 U3.1
N$48
  Top 0.152: R21.2 140.97,36.83 R47.2 140.97,33.66 142.56,32.07 142.56,25.72 143.19,25.72 143.83,25.08 IC21.1
N$49
  Top 0.152: IC22.1 153.35,20.95 152.72,20.95 152.72,24.45 151.13,26.04 R48.2 151.13,26.35 149.54,26.35 149.54,36.51
  Top 0.2: R22.2 149.54,36.78 149.54,36.51
N$50
  Top 0.152: 151.13,33.97 152.72,35.56 153.67,35.56 154.31,36.2 154.31,36.83 R23.2 | 151.13,33.97 149.86,33.97 149.86,31.11 152.08,28.89 153.99,28.89 153.99,25.08 IC23.1 | 151.13,33.97 R49.2
N$51
  Top 0.152: R24.2 160.66,36.83 160.66,33.34 161.29,32.7 161.61,32.7 161.93,32.38 R50.2 162.24,32.07 163.51,32.07 163.51,20.95 IC24.1
N$52
  Top 0.152: IC14.1 112.71,20.95 112.08,20.95 112.08,24.45 110.49,26.04 R40.2 110.49,26.35 108.9,26.35 108.9,36.83 R14.2
N$53
  Top 0.152: R15.2 110.49,36.83 R41.2 110.49,33.66 112.08,32.07 112.08,25.72 112.71,25.72 113.35,25.08 IC15.1
N$54
  Top 0.152: IC16.1 122.87,20.95 122.24,20.95 122.24,24.45 120.65,26.04 R42.2 120.65,26.35 119.06,26.35 119.06,36.83 R16.2
N$55
  Top 0.152: R17.2 120.65,36.83 R43.2 120.65,33.66 122.24,32.07 122.24,25.72 122.87,25.72 123.51,25.08 IC17.1
N$56
  Top 0.152: IC18.1 133.03,20.95 132.4,20.95 132.4,24.45 130.81,26.04 R44.2 130.81,26.35 129.22,26.35 129.22,36.83 R18.2
N$57
  Top 1.27: J3.1 IC5.4
N$58
  Top 1.27: J3.2 IC6.4 | IC6.4 69.85,15.24 71.12,13.97 71.12,12.7 70.61,12.7 IC6.4
N$59
  Top 1.27: J4.1 IC7.4
N$60
  Top 1.27: J4.2 IC8.4
N$61
  Top 1.27: J5.1 IC9.4
N$62
  Top 1.27: J5.2 IC10.4
N$63
  Top 1.27: J6.1 IC11.4
N$64
  Top 1.27: J6.2 IC12.4
N$65
  Top 1.27: J7.1 IC13.4
N$66
  Top 1.27: J7.2 IC14.4
N$67
  Top 1.27: J8.1 IC15.4
N$68
  Top 0.813: 120.65,13.97 IC16.4
  Top 1.27: J8.2 120.65,13.97
N$69
  Top 1.27: J9.1 IC17.4
N$70
  Top 1.27: J9.2 IC18.4
N$71
  Top 1.27: J10.1 IC19.4
N$72
  Top 1.27: J10.2 IC20.4
N$73
  Top 1.27: J11.1 IC21.4
N$74
  Top 1.27: J11.2 IC22.4
N$75
  Top 1.27: J12.1 IC23.4
N$76
  Top 1.27: J12.2 IC24.4
N$77
  Top 0.152: R19.1 134.3,36.83 137.79,40.32 U3.2
N$78
  Top 0.152: U3.3 139.06,39.37 138.11,38.42 137.48,38.42 137.48,36.83 R20.1
N$79
  Top 0.152: U3.4 140.34,39.37 141.29,38.42 144.15,38.42 144.15,36.83 R21.1
N$80
  Top 0.152: U3.5 141.6,38.73 144.46,38.73 146.37,36.83 R22.1
N$81
  Top 0.152: R23.1 152.08,36.83 150.18,38.73 145.1,38.73 144.78,39.05 144.15,39.05 142.88,40.32 U3.6
N$82
  Top 0.152: R24.1 157.8,36.83 152.72,41.91 144.78,41.91 143.83,40.96 143.83,40.64 144.15,40.64 U3.7
N$84
  Top 0.152: R10.1 87.63,37.73 87.63,39.37 95.25,39.37 95.89,40.01 U2.1
N$85
  Top 0.152: R52.1 16.88,4.18 MIDI.A
N$86
  Top 0.152: U$1.JP2.3 17.14,26.04 17.78,25.4 17.78,9.79 R52.2
RX
  Top 0.152: 6.99,23.18 7.62,22.54 U4.6 | 6.99,23.18 4.76,25.4 R26.1 | 6.99,23.18 8.89,25.08 J16.1
  Bottom 0.152: U$1.JP2.2 8.89,23.5 J16.1